# EasyEDA Pro project Motores.epro, schematic Schematic2
Board Name: Motores; Create Date: 2025-05-28; Page Name: P1; Project Name: Sansone; Schematic Name: Schematic2; Update Date: 2025-10-13; Company: EasyEDA.com; Drawn: Maximo Huykman; Page Size: A4; Reviewed: Maximo Huykman; Version: V1.0
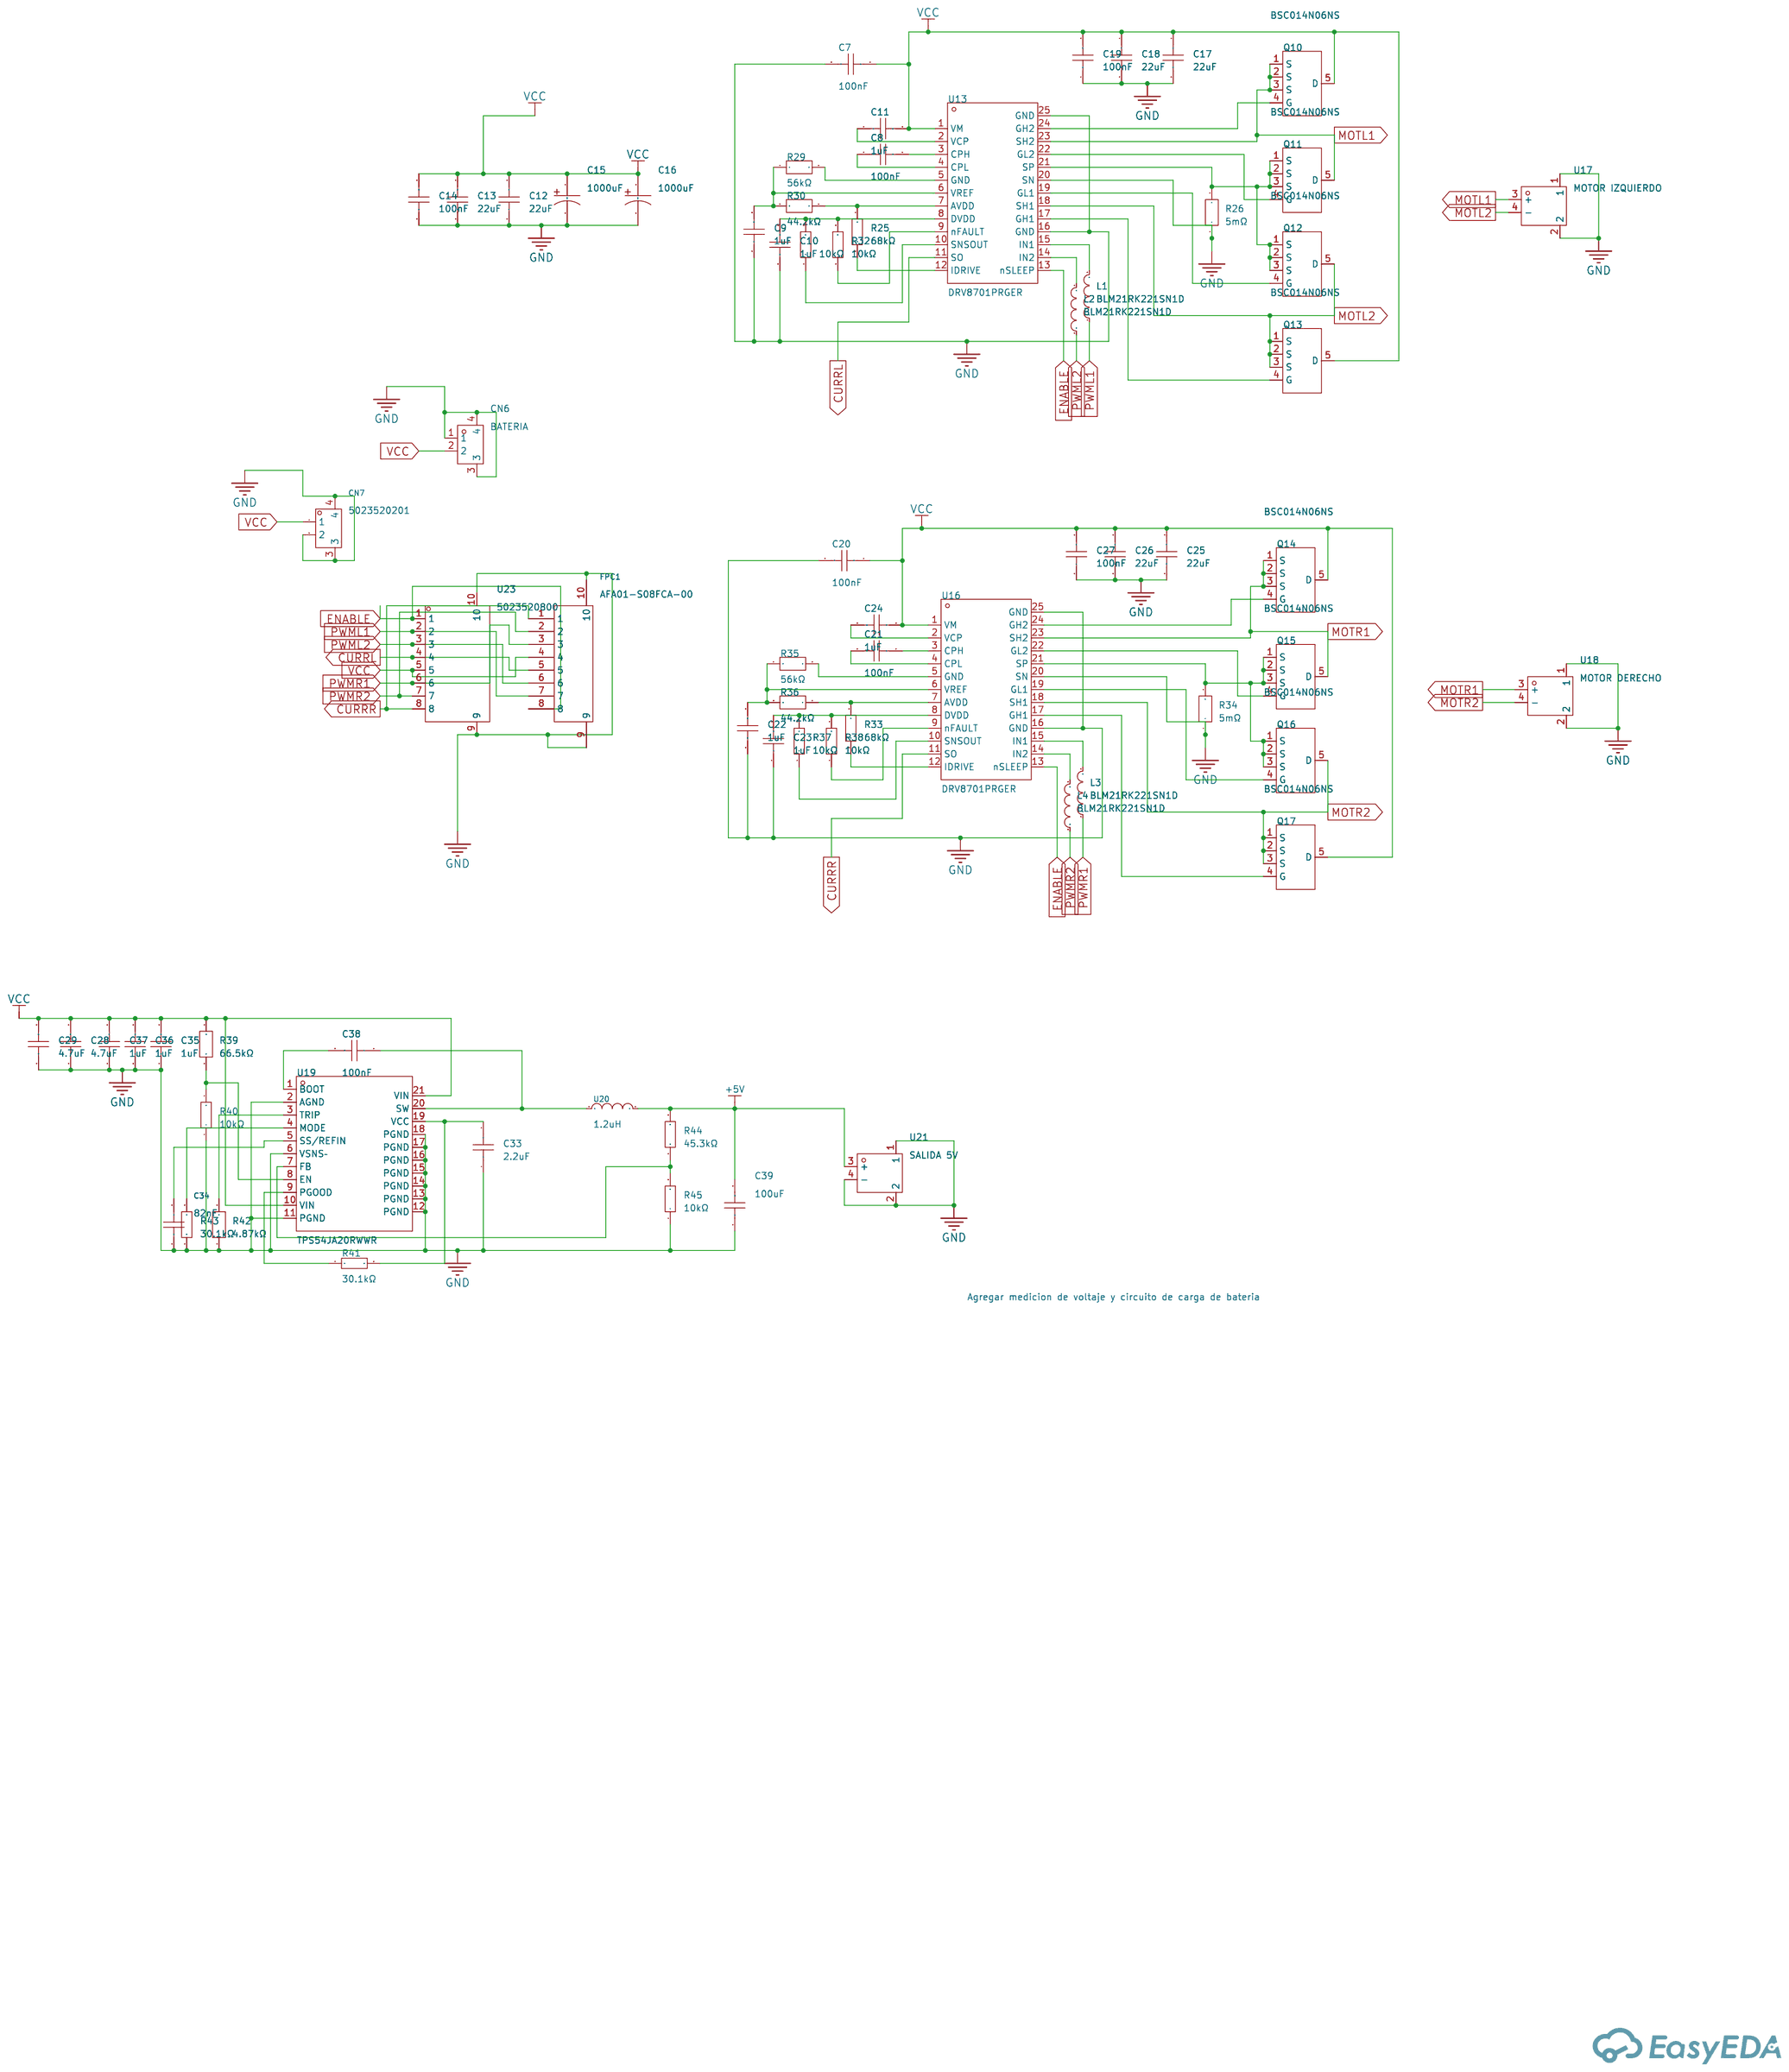
[diagram p0: schematic sheet]

## Parts
C7  100nF  [C0805]
C8  100nF  [C0805]
C9  1uF  [C0805]
C10  1uF  [C0805]
C11  1uF  [C0805]
C12  22uF  [C1210]
C13  22uF  [C1210]
C14  100nF  [C1206]
C15  1000uF  [CAP-SMD_BD10.0-L10.3-W10.3-FD]
C16  1000uF  [CAP-SMD_BD10.0-L10.3-W10.3-FD]
C17  22uF  [C1210]
C18  22uF  [C1210]
C19  100nF  [C1206]
C20  100nF  [C0805]
C21  100nF  [C0805]
C22  1uF  [C0805]
C23  1uF  [C0805]
C24  1uF  [C0805]
C25  22uF  [C1210]
C26  22uF  [C1210]
C27  100nF  [C1206]
C28  4.7uF  [C0805]
C29  4.7uF  [C0805]
C33  2.2uF  [C0805]
C34  82nF  [C0805]
C35  1uF  [C0805]
C36  1uF  [C0805]
C37  1uF  [C0805]
C38  100nF  [C1206]
C39  100uF  [C1210]
CN6  BATERIA  [CONN-TH_XT90PW-M.G.Y]
CN7  5023520201  [CONN-SMD_2P-P2.00_MOLEX_5023520201]
FPC1  AFA01-S08FCA-00  [FPC-SMD_8P-P1.00_FGS-XJ-H2.0]
L1  BLM21RK221SN1D  [L0805]
L2  BLM21RK221SN1D  [L0805]
L3  BLM21RK221SN1D  [L0805]
L4  BLM21RK221SN1D  [L0805]
Q10  BSC014N06NS  [POWERVDFN-8_L6.2-W5.2-P1.27-LS6.0-BL]
Q11  BSC014N06NS  [POWERVDFN-8_L6.2-W5.2-P1.27-LS6.0-BL]
Q12  BSC014N06NS  [POWERVDFN-8_L6.2-W5.2-P1.27-LS6.0-BL]
Q13  BSC014N06NS  [POWERVDFN-8_L6.2-W5.2-P1.27-LS6.0-BL]
Q14  BSC014N06NS  [POWERVDFN-8_L6.2-W5.2-P1.27-LS6.0-BL]
Q15  BSC014N06NS  [POWERVDFN-8_L6.2-W5.2-P1.27-LS6.0-BL]
Q16  BSC014N06NS  [POWERVDFN-8_L6.2-W5.2-P1.27-LS6.0-BL]
Q17  BSC014N06NS  [POWERVDFN-8_L6.2-W5.2-P1.27-LS6.0-BL]
R25  68kΩ  [R0805]
R26  5mΩ  [RES-SMD_L11.6-W7.0_WSR5]
R29  56kΩ  [R0603]
R30  44.2kΩ  [R0603]
R31  10kΩ  [R0805]
R32  10kΩ  [R0805]
R33  68kΩ  [R0805]
R34  5mΩ  [RES-SMD_L11.6-W7.0_WSR5]
R35  56kΩ  [R0603]
R36  44.2kΩ  [R0603]
R37  10kΩ  [R0805]
R38  10kΩ  [R0805]
R39  66.5kΩ  [R0805]
R40  10kΩ  [R0805]
R41  30.1kΩ  [R0805]
R42  4.87kΩ  [R0805]
R43  30.1kΩ  [R0805]
R44  45.3kΩ  [R0805]
R45  10kΩ  [R0805]
U13  DRV8701PRGER  [VQFN-24_L4.0-W4.0-P0.50-BL-EP2.8]
U16  DRV8701PRGER  [VQFN-24_L4.0-W4.0-P0.50-BL-EP2.8]
U17  MOTOR IZQUIERDO  [TH_2P-XT60PW-F]
U18  MOTOR DERECHO  [TH_2P-XT60PW-F]
U19  TPS54JA20RWWR  [TQFN-21_L4.0-W3.0-P0.40-TL_MPQ8633BGLE-Z]
U20  1.2uH  [IND-SMD_L7.0-W6.6_0630CDMCCDS]
U21  SALIDA 5V  [TH_2P-XT60PW-F]
U23  5023520800  [CONN-SMD_5023520800]

## Library data of the parts
C7 C8 C20 C21 = CC0805JRX7R8BB104: Capacitance: Tolerance:±5% Tolerance:±5% Voltage Rated: Temperature Coefficient:; LCSC Part Name: 100nF ±5% 25V; Supplier Part: C520083; Manufacturer: YAGEO(国巨); Supplier Footprint: 0805; JLCPCB Part Class: Extended Part; Datasheet: https://atta.szlcsc.com/upload/public/pdf/source/20200423/C520083_883E08DF8B255EC3DF9142BA4B83FEA8.pdf; Supplier: LCSC; Tolerance: ±5%
C9-C11 C22-C24 C35-C37 = CC0805JKX7R9BB105: Capacitance: Tolerance:±5% Tolerance:±5% Voltage Rated: Temperature Coefficient:; LCSC Part Name: 1uF ±5% 50V; Supplier Part: C541528; Manufacturer: YAGEO(国巨); Supplier Footprint: 0805; JLCPCB Part Class: Extended Part; Datasheet: https://atta.szlcsc.com/upload/public/pdf/source/20200615/C541528_3316C96F16E83D111D4F7F377579D94B.pdf; Supplier: LCSC; Tolerance: ±5%
C12 C13 C17 C18 C25 C26 = GCM32ER71C226KE19L: Capacitance: Tolerance:±10% Tolerance:±10% Voltage Rated: Temperature Coefficient:; LCSC Part Name: 22uF ±10% 16V; Supplier Part: C126614; Manufacturer: muRata(村田); Supplier Footprint: 1210; JLCPCB Part Class: Extended Part; Datasheet: https://atta.szlcsc.com/upload/public/pdf/source/20170912/C126614_1505207923958963711.pdf; Supplier: LCSC; Tolerance: ±10%
C14 C19 C27 C38 = GRM31C5C1H104FA01L: Capacitance:100nF Tolerance:±1% Tolerance:±1% Voltage Rating:50V Temperature Coefficient:C0G; LCSC Part Name: 100nF ±1% 50V; Supplier Part: C2981728; Manufacturer: muRata(村田); Supplier Footprint: 1206; JLCPCB Part Class: Extended Part; Datasheet: https://atta.szlcsc.com/upload/public/pdf/source/20200305/C490387_23319AE8C154DEB24C505E6C82A8106A.pdf; Supplier: LCSC; Tolerance: ±1%; Voltage Rating: 50V; Temperature Coefficient: C0G
C15 C16 = 16SVPF1000M: Capacitance: Tolerance:±20% Tolerance:±20% Rated Voltage: Ripple Current:5.4A@100kHz Equivalent Series Resistance(ESR):12mΩ@100kHz Type:Polymer Lead Spacing: φD: L: Lifetime @ Temp:5000hrs@105℃ Operating Temperature:-55℃~+105℃ Operating Temperature:-55℃~+; LCSC Part Name: 1000uF ±20% 16V; Supplier Part: C236289; Manufacturer: PANASONIC(松下); Supplier Footprint: SMD,D10xL12.6mm; JLCPCB Part Class: Extended Part; Datasheet: https://atta.szlcsc.com/upload/public/pdf/source/20180719/C236289_AB5254F1B50726D06D6A62B2D96728A0.pdf; Supplier: LCSC; Tolerance: ±20%; Ripple Current: 5.4A@100kHz; Equivalent Series Resistance(ESR): 12mΩ@100kHz; Type: Polymer; Lifetime @ Temp: 5000hrs@105℃; Operating Temperature: -55℃~+105℃
C28 C29 = GRM21BZ71H475KE15L: Capacitance: Tolerance:±10% Tolerance:±10% Voltage Rated: Temperature Coefficient:; LCSC Part Name: 4.7uF ±10% 50V; Supplier Part: C437557; Manufacturer: muRata(村田); Supplier Footprint: 0805; JLCPCB Part Class: Extended Part; Datasheet: https://atta.szlcsc.com/upload/public/pdf/source/20191226/C475964_3FAF76C90CD8FFB09F50C7480ADA926F.pdf; Supplier: LCSC; Tolerance: ±10%
C33 = CS2012X5R225K500NRE: Capacitance:2.2uF Tolerance:±10% Tolerance:±10% Voltage Rating:50V Temperature Coefficient:X5R; LCSC Part Name: 2.2uF ±10% 50V; Supplier Part: C513763; Manufacturer: SAMWHA(三和); Supplier Footprint: 0805; JLCPCB Part Class: Extended Part; Datasheet: https://atta.szlcsc.com/upload/public/pdf/source/20200508/C516002_82A434E5D41789A45A49935C47D768D3.pdf; Supplier: LCSC; Tolerance: ±10%; Voltage Rating: 50V; Temperature Coefficient: X5R
C34 = 0805B823K500CT: Capacitance: Tolerance:±10% Tolerance:±10% Voltage Rated: Temperature Coefficient:; LCSC Part Name: 82nF ±10% 50V; Supplier Part: C396736; Manufacturer: Walsin(华新科); Supplier Footprint: 0805; JLCPCB Part Class: Extended Part; Datasheet: https://atta.szlcsc.com/upload/public/pdf/source/20191217/C469650_84AD5C6F618CF4AC0C6D987F2E8FE6F8.pdf; Supplier: LCSC; Tolerance: ±10%
C39 = C3225X6S0J107MT000N: Capacitance:100uF Tolerance:±20% Tolerance:±20% Voltage Rating:6.3V Temperature Coefficient:X6S; LCSC Part Name: 100uF ±20% 6.3V; Supplier Part: C342609; Manufacturer: TDK; Supplier Footprint: 1210; JLCPCB Part Class: Extended Part; Datasheet: https://atta.szlcsc.com/upload/public/pdf/source/20190612/C361180_85CC9FB0751BEA97238DE56AB4AF0B1F.pdf; Supplier: LCSC; Tolerance: ±20%; Voltage Rating: 6.3V; Temperature Coefficient: X6S
CN6 = XT90PW-M.G.Y: Power:- Output:- Input:- Size:- Interface:- Type:- Colour:Yellow MaximumCurrent:- Type:Plug RatedVoltage:DC 500V Type1:- NumberOfUSBHoles:- InterfaceType:- MetalMaterial:镀金 InsulationMaterial:PA RatedCurrent:30A RecommendedWireGauge:8/10/12AWG FlameRetard; LCSC Part Name: XT90PW-M.G.Y 插头; Supplier Part: C3040689; Manufacturer: AMASS(艾迈斯); JLCPCB Part Class: Extended Part; Datasheet: https://atta.szlcsc.com/upload/public/pdf/source/20220706/DF28D7D1C359D70D8DC121EBAA932DBE.pdf; Supplier: LCSC; Type: Plug; Colour: Yellow; RatedVoltage: DC 500V; MetalMaterial: 镀金; InsulationMaterial: PA; RatedCurrent: 30A; RecommendedWireGauge: 8/10/12AWG; contact resistance: 0.4mΩ; specifications: 7.4mm
CN7 = 5023520201: Pins Structure:1x2P Pitch:2mm Mounting Style:卧贴 Reference Series:- Number of Pins:2P Number of Rows:1 Number of PINs Per Row:2 Row Spacing:- Current Rating (Max):- Contact Material:Copper Alloy Operating Temperature Range:- Operating Temperature Range:-; LCSC Part Name: 1x2P 间距:2mm 卧贴; Supplier Part: C587898; Manufacturer: MOLEX; Supplier Footprint: SMD,P=2mm,卧贴; JLCPCB Part Class: Extended Part; Datasheet: https://atta.szlcsc.com/upload/public/pdf/source/20210916/A33558650610DEBF51F176E4907AAE8E.pdf; Supplier: LCSC; Pins Structure: 1x2P; Pitch: 2mm; Mounting Style: 卧贴; Number of Pins: 2P; Number of Rows: 1; Number of PINs Per Row: 2; Contact Material: Copper Alloy
FPC1 = AFA01-S08FCA-00: Locking Feature:Clamshell Contact Type:Bottom Contact Number of Contacts:8P Pitch:1mm Mounting Type:卧贴 FFC, FCB Thickness:0.3mm FFC, FCB Thickness:0.3mm Height Above Board:2mm; LCSC Part Name: 间距:1mm P数:8P 翻盖式 下接; Supplier Part: C262755; Manufacturer: JS(钜硕电子); Supplier Footprint: SMD,P=1mm,卧贴; JLCPCB Part Class: Extended Part; Datasheet: https://atta.szlcsc.com/upload/public/pdf/source/20180820/C262762_EBECD0847A529CA64FD00527F6604CA9.pdf; Supplier: LCSC; Locking Feature: Clamshell; Contact Type: Bottom Contact; Number of Contacts: 8P; Pitch: 1mm; Mounting Type: 卧贴; FFC, FCB Thickness: 0.3mm; Height Above Board: 2mm
L1-L4 = BLM21RK221SN1D: Impedance @ Frequency:220Ω@100MHz Tolerance:±25% Tolerance:±25% DC Resistance:200mΩ Current Rating:200mA Circuits:1; LCSC Part Name: 单路 0805磁珠 阻抗220Ω@100MHz; Supplier Part: C710511; Manufacturer: muRata(村田); Supplier Footprint: 0805; JLCPCB Part Class: Extended Part; Datasheet: https://atta.szlcsc.com/upload/public/pdf/source/20210606/F3F13CB7AA6F7BFC37924E68B8587F8A.pdf; Supplier: LCSC; Impedance @ Frequency: 220Ω@100MHz; Tolerance: ±25%; DC Resistance: 200mΩ; Current Rating: 200mA; Circuits: 1
Q10-Q17 = BSC014N06NS: Type:1 N-channel Drain to Source Voltage:60V Current - Continuous Drain(Id): RDS(on):1.45mΩ@10V,50A Pd - Power Dissipation:156W Gate Threshold Voltage (Vgs(th)@Id):3.3V Gate Charge(Qg):89nC Input Capacitance(Ciss@Vds):8.125nF@30V Reverse Transfer Capacita; LCSC Part Name: 1个N沟道 耐压:60V 电流:100A; Supplier Part: C113391; Manufacturer: Infineon(英飞凌); Supplier Footprint: TDSON-8-FL; JLCPCB Part Class: Extended Part; Datasheet: https://atta.szlcsc.com/upload/public/pdf/source/20170912/C113391_1505207758223963392.pdf; Supplier: LCSC; Type: 1 N-channel; Drain to Source Voltage: 60V; RDS(on): 1.45mΩ@10V,50A; Pd - Power Dissipation: 156W; Gate Threshold Voltage (Vgs(th)@Id): 3.3V; Gate Charge(Qg): 89nC; Input Capacitance(Ciss@Vds): 8.125nF@30V; Reverse Transfer Capacitance (Crss@Vds): 118pF@30V; Operating Temperature: -55℃~+150℃; Check: true
R25 R33 = RC0805FR-0768KL: Type:Thick Film Resistors Resistance: Tolerance:±1% Tolerance:±1% Power(Watts): Overload Voltage (Max): Temperature Coefficient:±100ppm/℃ Temperature Coefficient:±100ppm/℃ Operating Temperature Range:-55℃~+155℃ Operating Temperature Range:-55℃~+155℃; LCSC Part Name: 厚膜电阻 68kΩ ±1% 125mW; Supplier Part: C114548; Manufacturer: YAGEO(国巨); Supplier Footprint: 0805; JLCPCB Part Class: Extended Part; Datasheet: https://atta.szlcsc.com/upload/public/pdf/source/20180821/C275644_0D56F95EFF785E7D9A1FEF436B37DA78.pdf; Supplier: LCSC; Type: Thick Film Resistors; Tolerance: ±1%; Temperature Coefficient: ±100ppm/℃; Operating Temperature Range: -55℃~+155℃
R26 R34 = WSR55L000FEA: Type:Current Sensing Resistors Resistance:5mΩ Tolerance:±1% Tolerance:±1% Rated Output Voltage:- Power(Watts): Rated Current:- Temperature Coefficient:±110ppm/℃ Temperature Coefficient:±110ppm/℃ Mounting Sytle:Patch; LCSC Part Name: 5mΩ ±1% 5W; Supplier Part: C2094530; Manufacturer: VISHAY(威世); Supplier Footprint: 4527; JLCPCB Part Class: Extended Part; Datasheet: https://atta.szlcsc.com/upload/public/pdf/source/20210602/6318A596CA54BC80BB28BE2A0BF0DA84.pdf; Supplier: LCSC; Type: Current Sensing Resistors; Tolerance: ±1%; Temperature Coefficient: ±110ppm/℃; Mounting Sytle: Patch
R29 R35 = RT0603BRD0756KL: Type:Thin Film Resistor Resistance: Tolerance:±0.1% Tolerance:±0.1% Power(Watts): Overload Voltage (Max): Temperature Coefficient:±25ppm/℃ Temperature Coefficient:±25ppm/℃ Operating Temperature Range:-55℃~+155℃ Operating Temperature Range:-55℃~+155℃; LCSC Part Name: 薄膜电阻 56kΩ ±0.1% 100mW; Supplier Part: C705785; Manufacturer: YAGEO(国巨); Supplier Footprint: 0603; JLCPCB Part Class: Extended Part; Datasheet: https://atta.szlcsc.com/upload/public/pdf/source/20200720/C705785_D065C0A48D0F100674ACC976DA07E3F0.pdf; Supplier: LCSC; Type: Thin Film Resistor; Tolerance: ±0.1%; Temperature Coefficient: ±25ppm/℃; Operating Temperature Range: -55℃~+155℃
R30 R36 = RT0603BRD0744K2L: Type:Thin Film Resistor Resistance:44.2kΩ Tolerance:±0.1% Tolerance:±0.1% Power(Watts):100mW Temperature Coefficient:±25ppm/℃ Temperature Coefficient:±25ppm/℃ Operating Temperature:-55℃~+155℃ Operating Temperature:-55℃~+155℃; LCSC Part Name: 薄膜电阻 44.2kΩ ±0.1% 100mW; Supplier Part: C861410; Manufacturer: YAGEO(国巨); Supplier Footprint: 0603; JLCPCB Part Class: Extended Part; Datasheet: https://atta.szlcsc.com/upload/public/pdf/source/20200610/C326738_5639A9F1B6EB6E4AE2197577D3456E7F.pdf; Supplier: LCSC; Type: Thin Film Resistor; Tolerance: ±0.1%; Power(Watts): 100mW; Temperature Coefficient: ±25ppm/℃; Operating Temperature: -55℃~+155℃
R31 R32 R37 R38 R40 R45 = 0805W8F1002T5E: Type:Thick Film Resistors Resistance:10kΩ Tolerance:±1% Tolerance:±1% Power(Watts): Overload Voltage (Max): Temperature Coefficient:±100ppm/℃ Temperature Coefficient:±100ppm/℃ Operating Temperature Range:-55℃~+155℃ Operating Temperature Range:-55℃~+155℃; LCSC Part Name: 10kΩ ±1% 125mW 厚膜电阻; Supplier Part: C17414; Manufacturer: UNI-ROYAL(厚声); Supplier Footprint: 0805; JLCPCB Part Class: Basic Part; Datasheet: https://atta.szlcsc.com/upload/public/pdf/source/20200306/C422600_1E6D84923E4A46A82E41ADD87F860B5C.pdf; Supplier: LCSC; Type: Thick Film Resistors; Tolerance: ±1%; Temperature Coefficient: ±100ppm/℃; Operating Temperature Range: -55℃~+155℃
R39 = FRC0805F6652TS: Type:Thick Film Resistors Resistance:66.5kΩ Tolerance:±1% Tolerance:±1% Power(Watts): Overload Voltage (Max): Temperature Coefficient:±100ppm/℃ Temperature Coefficient:±100ppm/℃; LCSC Part Name: 66.5kΩ ±1% 125mW 厚膜电阻; Supplier Part: C3013227; Manufacturer: FOJAN(富捷); Supplier Footprint: 0805; JLCPCB Part Class: Extended Part; Datasheet: https://atta.szlcsc.com/upload/public/pdf/source/20211221/925EC7D7225764EE0046F22065062C87.pdf; Supplier: LCSC; Type: Thick Film Resistors; Tolerance: ±1%; Temperature Coefficient: ±100ppm/℃
R41 R43 = RS-05K3012FT: Type:Thick Film Resistors Resistance:30.1kΩ Tolerance:±1% Tolerance:±1% Power(Watts): Overload Voltage (Max): Temperature Coefficient:±100ppm/℃ Temperature Coefficient:±100ppm/℃ Operating Temperature Range:-55℃~+155℃ Operating Temperature Range:-55℃~+155℃; LCSC Part Name: 厚膜电阻 30.1kΩ ±1% 125mW; Supplier Part: C322410; Manufacturer: FH(风华); Supplier Footprint: 0805; JLCPCB Part Class: Extended Part; Datasheet: https://atta.szlcsc.com/upload/public/pdf/source/20140616/1457707091974.pdf; Supplier: LCSC; Type: Thick Film Resistors; Tolerance: ±1%; Temperature Coefficient: ±100ppm/℃; Operating Temperature Range: -55℃~+155℃
R42 = FRC0805F4871TS: Type:Thick Film Resistors Resistance:4.87kΩ Tolerance:±1% Tolerance:±1% Power(Watts): Overload Voltage (Max): Temperature Coefficient:±100ppm/℃ Temperature Coefficient:±100ppm/℃ Operating Temperature Range:-55℃~+155℃ Operating Temperature Range:-55℃~+155℃; LCSC Part Name: 4.87kΩ ±1% 125mW 厚膜电阻; Supplier Part: C2930197; Manufacturer: FOJAN(富捷); Supplier Footprint: 0805; JLCPCB Part Class: Extended Part; Datasheet: https://atta.szlcsc.com/upload/public/pdf/source/20211221/925EC7D7225764EE0046F22065062C87.pdf; Supplier: LCSC; Type: Thick Film Resistors; Tolerance: ±1%; Temperature Coefficient: ±100ppm/℃; Operating Temperature Range: -55℃~+155℃
R44 = RS-05K4532FT: Type:Thick Film Resistors Resistance:45.3kΩ Tolerance:±1% Tolerance:±1% Power(Watts): Overload Voltage (Max): Temperature Coefficient:±100ppm/℃ Temperature Coefficient:±100ppm/℃ Operating Temperature Range:-55℃~+155℃ Operating Temperature Range:-55℃~+155℃; LCSC Part Name: 厚膜电阻 45.3kΩ ±1% 125mW; Supplier Part: C322483; Manufacturer: FH(风华); Supplier Footprint: 0805; JLCPCB Part Class: Extended Part; Datasheet: https://atta.szlcsc.com/upload/public/pdf/source/20140616/1457707091974.pdf; Supplier: LCSC; Type: Thick Film Resistors; Tolerance: ±1%; Temperature Coefficient: ±100ppm/℃; Operating Temperature Range: -55℃~+155℃
U13 U16 = DRV8701PRGER: Voltage - Supply:- Voltage - Supply:- Output Current:- Output Current:- Operating Temperature:-40℃~+125℃ Operating Temperature:-40℃~+125℃; LCSC Part Name: 有刷直流电机驱动芯片 5.5V; Supplier Part: C114178; Manufacturer: TI(德州仪器); Supplier Footprint: VQFN-24-EP(4x4); JLCPCB Part Class: Extended Part; Datasheet: https://www.ti.com/cn/lit/gpn/drv8701; Supplier: LCSC; Operating Temperature: -40℃~+125℃
U17 U18 U21 = XT60PW-F: Power:- Output:- Input:- Size:- Interface:- Type:- Colour:Yellow MaximumCurrent:- Type:卧式插头 RatedVoltage:- Type1:- NumberOfUSBHoles:- InterfaceType:母头 MetalMaterial:- InsulationMaterial:- RatedCurrent:- RecommendedWireGauge:- FlameRetardantGrade:- contact; LCSC Part Name: AMASS(艾迈斯)插头连接器锂电池组充电接口 航模电调卧式焊板 母头 XT60PW-F; Supplier Part: C428722; Manufacturer: AMASS(艾迈斯); JLCPCB Part Class: Extended Part; Datasheet: https://atta.szlcsc.com/upload/public/pdf/source/20190916/C428722_DFF78979486FCB0B58C1FC563067EC88.pdf; Supplier: LCSC; Type: 卧式插头; Colour: Yellow; InterfaceType: 母头
U19 = TPS54JA20RWWR: Function:Step-down type Output Type:Adjustable Input Voltage:2.7V~16V Input Voltage:2.7V~16V Output Voltage:900mV~5.5V Output Voltage:900mV~5.5V Output Current:12A Switching Frequency:1MHz；600kHz；800kHz Switching Frequency:1MHz；600kHz；800kHz Operating Tem; Supplier Part: C3188717; Manufacturer: TI(德州仪器); Supplier Footprint: VQFN-21-HR(4x3); JLCPCB Part Class: Extended Part; Datasheet: https://www.ti.com/cn/lit/gpn/tps54ja20; Supplier: LCSC; Function: Step-down type; Output Type: Adjustable; Input Voltage: 2.7V~16V; Output Voltage: 900mV~5.5V; Output Current: 12A; Switching Frequency: 1MHz；600kHz；800kHz; Operating Temperature: -40℃~+125℃@(TJ); Synchronous Rectification: Yes; Number of Outputs: 1; Topology: Step-down; Switch tube (built-in/external): Built-in
U20 = 0630CDMCDDS-1R2MC: Inductance: Tolerance:±20% Tolerance:±20% Rated Current:17.8A Saturation Current (Isat):17.8A DC Resistance (DCR): Type:- Ratings:-; LCSC Part Name: 1.2uH ±20% 17.8A; Supplier Part: C2453293; Manufacturer: Sumida(胜美达); Supplier Footprint: SMD,7x6.6mm; JLCPCB Part Class: Extended Part; Datasheet: https://atta.szlcsc.com/upload/public/pdf/source/20200309/C492723_5B4769124B99343D76BBAFA56B014E05.pdf; Supplier: LCSC; Tolerance: ±20%; Rated Current: 17.8A; Saturation Current (Isat): 17.8A
U23 = 5023520800: Pins Structure:1x8P Pitch:2mm Mounting Style:Horizontal attachment Reference Series:- Number of Pins:8P Number of Rows:1 Number of PINs Per Row:8 Row Spacing:- Contact Material:Copper alloy Contact Plating:Tin; Supplier Part: C114105; Manufacturer: MOLEX; Supplier Footprint: SMD,P=2mm,卧贴; JLCPCB Part Class: Extended Part; Datasheet: https://www.molex.com/content/dam/molex/molex-dot-com/products/automated/en-us/salesdrawingpdf/502/502352/5023520800_sd.pdf?inline\; Supplier: LCSC; Pins Structure: 1x8P; Pitch: 2mm; Mounting Style: Horizontal attachment; Number of Pins: 8P; Number of Rows: 1; Number of PINs Per Row: 8; Contact Material: Copper alloy; Contact Plating: Tin

## Nets
+5V: C39.2 R44.2 U20.2 U21.3(+)
GND: C7.2 C9.1 C10.1 C12.2 C13.2 C14.1 C15.2 C16.2 C17.2 C18.2 C19.1 C20.2 C22.1 C23.1 C25.2 C26.2 C27.1 C28.1 C29.1 C33.1 C34.1 C35.1 C36.1 C37.1 C39.1 CN6.1 CN6.3 CN6.4 CN7.2 CN7.3 CN7.4 FPC1.9 FPC1.10 R26.1 R34.1 R40.1 R42.1 R43.1 R45.1 U13.16(GND) U13.20(SN) U13.25(GND) U16.16(GND) U16.20(SN) U16.25(GND) U17.1 U17.2 U18.1 U18.2 U19.2(AGND) U19.6(VSNS–) U19.11(PGND) U19.12(PGND) U19.13(PGND) U19.14(PGND) U19.15(PGND) U19.16(PGND) U19.17(PGND) U19.18(PGND) U21.1 U21.2 U21.4(-) U23.9 U23.10
VCC: C7.1 C11.2 C12.1 C13.1 C14.2 C15.1 C16.1 C17.1 C18.1 C19.2 C20.1 C24.2 C25.1 C26.1 C27.2 C28.2 C29.2 C35.2 C36.2 C37.2 CN6.2 CN7.1 FPC1.4 Q10.5(D) Q13.5(D) Q14.5(D) Q17.5(D) R39.2 U13.1(VM) U16.1(VM) U19.10(VIN) U19.21(VIN) U23.5
CURRL: FPC1.5 U13.11(SO) U23.4
CURRR: FPC1.1 U16.11(SO) U23.8
ENABLE: FPC1.8 U13.13(nSLEEP) U16.13(nSLEEP) U23.1
MOTL1: Q10.1(S) Q10.2(S) Q10.3(S) Q11.5(D) U13.23(SH2) U17.3(+)
MOTL2: Q12.5(D) Q13.1(S) Q13.2(S) Q13.3(S) U13.18(SH1) U17.4(-)
MOTR1: Q14.1(S) Q14.2(S) Q14.3(S) Q15.5(D) U16.23(SH2) U18.3(+)
MOTR2: Q16.5(D) Q17.1(S) Q17.2(S) Q17.3(S) U16.18(SH1) U18.4(-)
PWML1: FPC1.7 L1.1 U23.2
PWML2: FPC1.6 L2.1 U23.3
PWMR1: FPC1.3 L3.1 U23.6
PWMR2: FPC1.2 L4.1 U23.7
$1N1542: R25.1 R30.1 U13.7(AVDD)
$1N1548: R29.2 U13.5(GND)
$1N1553: C9.2 R29.1 R30.2 U13.6(VREF)
$1N1568: R25.2 U13.12(IDRIVE)
$1N2215: C10.2 R31.2 R32.2 U13.8(DVDD)
$1N2263: R32.1 U13.9(nFAULT)
$1N2273: R31.1 U13.10(SNSOUT)
$1N2281: C8.1 U13.3(CPH)
$1N2285: C8.2 U13.4(CPL)
$1N2295: C11.1 U13.2(VCP)
$1N2619: Q10.4(G) U13.24(GH2)
$1N2625: Q11.4(G) U13.22(GL2)
$1N2752: Q11.1(S) Q11.2(S) Q11.3(S) Q12.1(S) Q12.2(S) Q12.3(S) R26.2 U13.21(SP)
$1N2818: Q12.4(G) U13.19(GL1)
$1N2842: Q13.4(G) U13.17(GH1)
$1N3497: L1.2 U13.15(IN1)
$1N3553: L2.2 U13.14(IN2)
$1N4560: R33.1 R36.1 U16.7(AVDD)
$1N4563: R35.2 U16.5(GND)
$1N4566: C22.2 R35.1 R36.2 U16.6(VREF)
$1N4571: R33.2 U16.12(IDRIVE)
$1N4574: C23.2 R37.2 R38.2 U16.8(DVDD)
$1N4592: R38.1 U16.9(nFAULT)
$1N4599: R37.1 U16.10(SNSOUT)
$1N4606: C21.1 U16.3(CPH)
$1N4608: C21.2 U16.4(CPL)
$1N4625: C24.1 U16.2(VCP)
$1N4628: Q14.4(G) U16.24(GH2)
$1N4632: Q15.4(G) U16.22(GL2)
$1N4654: Q15.1(S) Q15.2(S) Q15.3(S) Q16.1(S) Q16.2(S) Q16.3(S) R34.2 U16.21(SP)
$1N4665: Q16.4(G) U16.19(GL1)
$1N4669: Q17.4(G) U16.17(GH1)
$1N4689: L3.2 U16.15(IN1)
$1N4694: L4.2 U16.14(IN2)
$1N8343: C33.2 R41.2 U19.19(VCC)
$1N8410: R41.1 U19.9(PGOOD)
$1N8467: R39.1 R40.2 U19.8(EN)
$1N8544: R43.2 U19.4(MODE)
$1N8550: R42.2 U19.3(TRIP)
$1N8556: C34.2 U19.5(SS/REFIN)
$1N8600: C38.2 U19.1(BOOT)
$1N8605: C38.1 U19.20(SW) U20.1
$1N8628: R44.1 R45.2 U19.7(FB)

## Notes on the sheet
- Agregar medicion de voltaje y circuito de carga de bateria
